# Altium schematic sheet Revisions History.SchDoc: Revisions History
size A3; Author: DODANHLUONG; Revision: 1.0; SheetNumber: 1; SheetTotal: 6; ProjectTitle: KIT ARDUINO VERSION 1.0
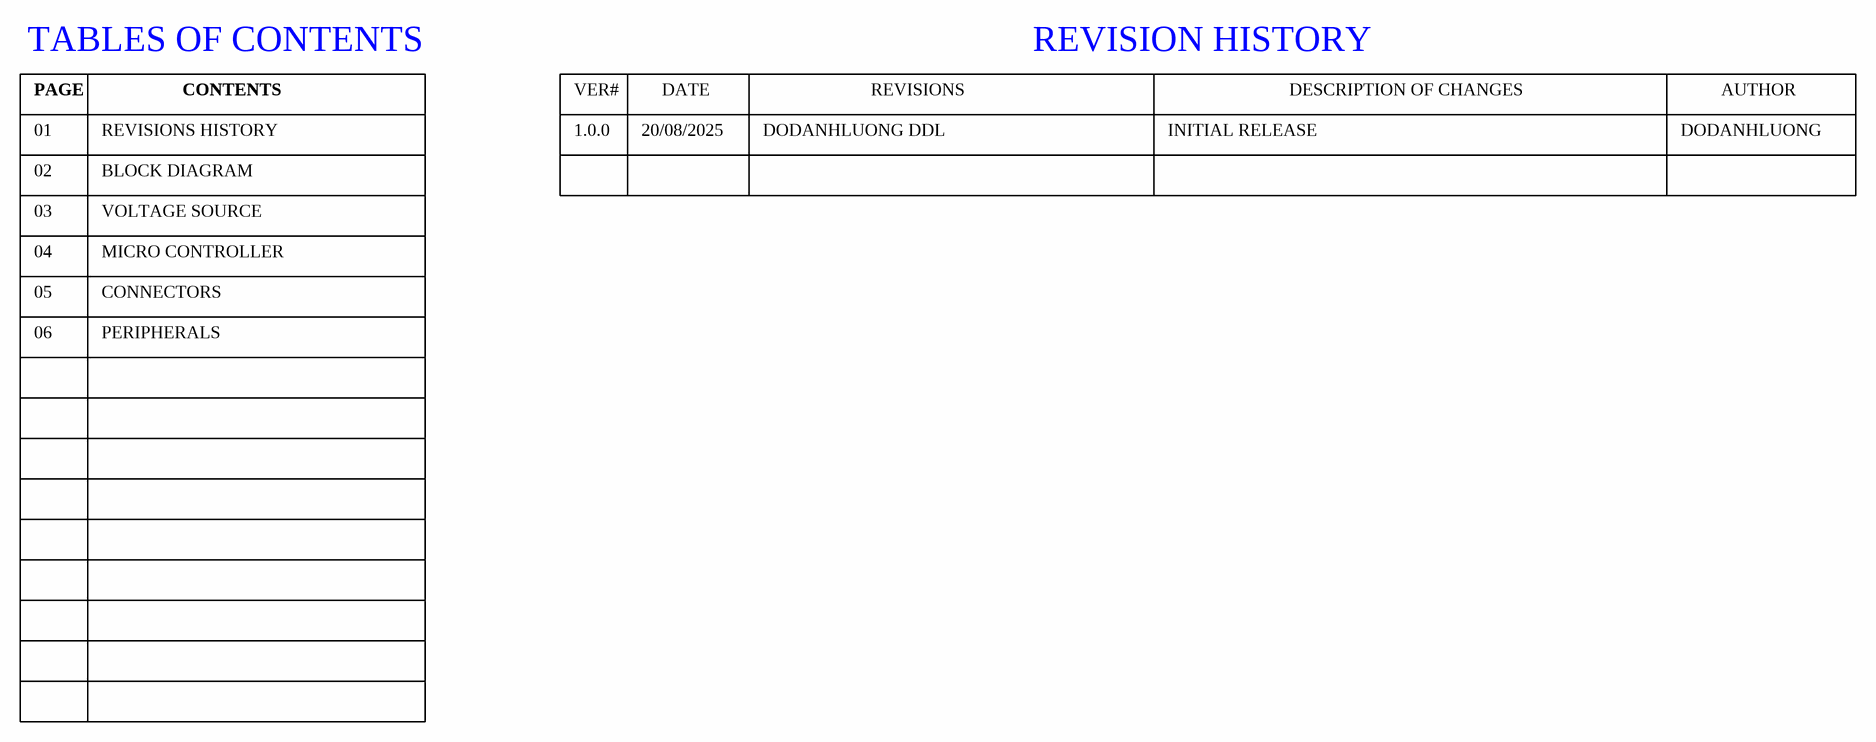
[diagram p0: Revisions History.SchDoc]

## Notes on the sheet
- TABLES OF CONTENTS
- REVISION HISTORY
- PAGE
- 01
- REVISIONS HISTORY
- CONTENTS
- VER#
- 1.0.0
- 20/08/2025
- DATE
- DODANHLUONG DDL
- REVISIONS
- INITIAL RELEASE
- DESCRIPTION OF CHANGES
- DODANHLUONG
- AUTHOR
- 02
- BLOCK DIAGRAM
- 03
- 04
- MICRO CONTROLLER
- VOLTAGE SOURCE
- 05
- 06
- CONNECTORS
- PERIPHERALS
- Author:
- Title:
- Size:
- A3
- Project:
- Revision:
- Modified Date:
- CheckedBy:
- Date:
- SW Version: